# Altium schematic sheet 2DIR_Digital_Isolator.SchDoc: STM32F446 CNC
size B; Author: AM; CompanyName: Expatria Technologies; DrawnBy: A.Marles; Engineer: AM; Organization: Expatria Technolgoies; DocumentNumber: 9; SheetNumber: 9; SheetTotal: 14
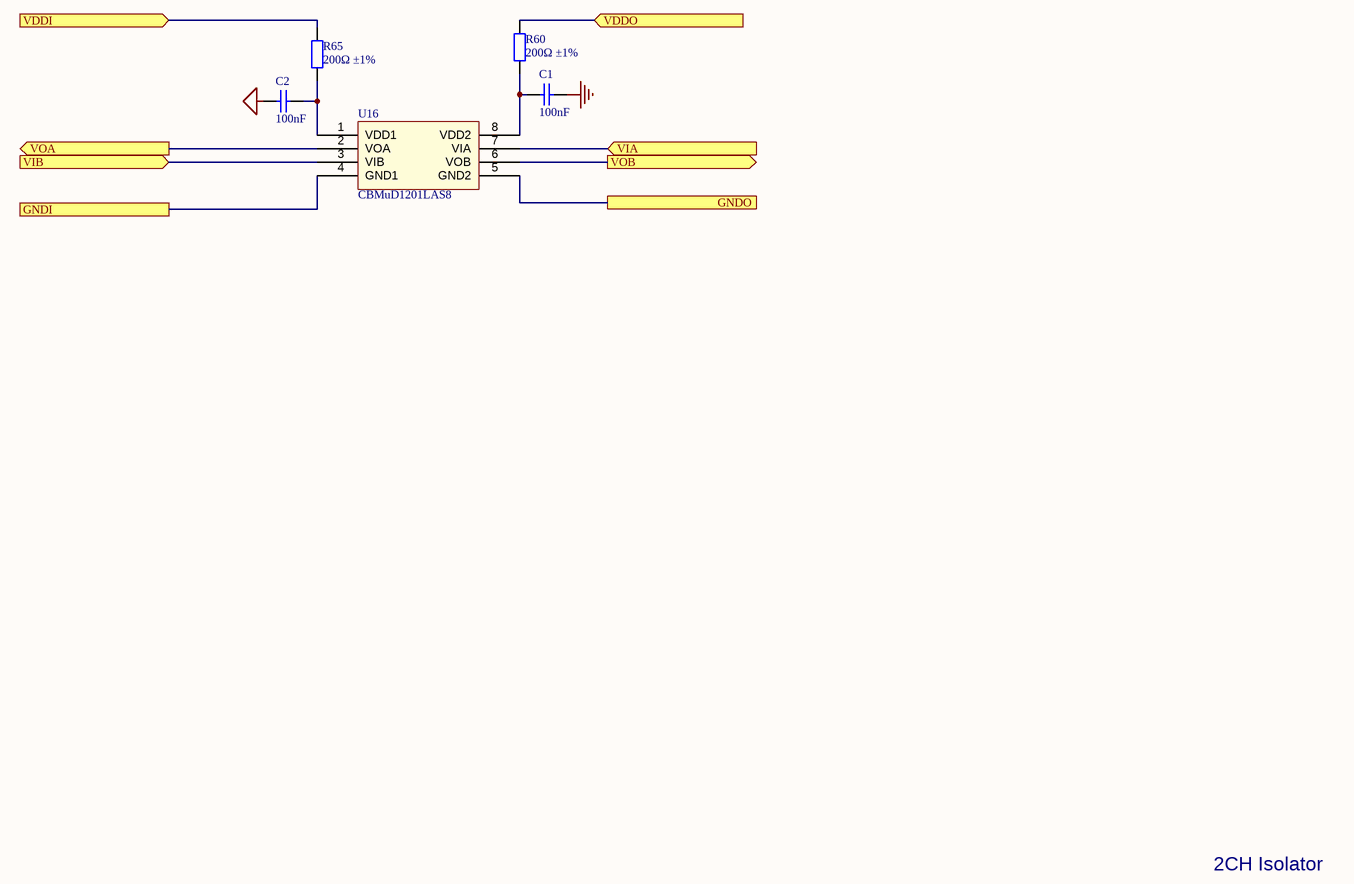
[diagram p0: 2DIR_Digital_Isolator.SchDoc]

## Parts
C1  100nF  [0603_C]
C2  100nF  [0603_C]
R60  200Ω ±1%  [0603_R]
R65  200Ω ±1%  [0603_R]
U16  CBMuD1201LAS8  [SOIC-8_150mil]

## Ports
GNDI, GNDO, VDDI (in), VDDO (in), VIA (in), VIB (in), VOA (out), VOB (out)

## Nets
GND: C1.1
MCU_GND: C2.2
GNDI: U16.4(GND1) ; port GNDI
GNDO: U16.5(GND2) ; port GNDO
VDDI: R65.2 ; port VDDI
VDDO: R60.2 ; port VDDO
VIA: U16.7(VIA) ; port VIA
VIB: U16.3(VIB) ; port VIB
VOA: U16.2(VOA) ; port VOA
VOB: U16.6(VOB) ; port VOB
NetC1_2: C1.2 R60.1 U16.8(VDD2)
NetC2_1: C2.1 R65.1 U16.1(VDD1)

## Notes on the sheet
- 2CH Isolator
- SHEET
- Expatria Technologies
- 1136 Glade Court
- Port Coquitlam, BC V3B 1R5
- PROJECT
- SIZE
- ENGR
- MODIFIED
- DOCUMENT
- REV
- Copyright Expatria Technologies 2022. This document describes Open Hardware and is licensed under the CERN-OHL-S v2. No warranty is implied or expressed.
- EMAIL: INFO@EXPATRIA.CA
- B
- /

## Library data of the parts
C1 C2 = 0603 100nF (104) 10% 50V: Chip capacitors; Manufacturer: YAGEO; PartNumber: CC0603KRX7R9BB104; Tolerance: 10%; Voltage: 50V; ComponentLink1Description: Supplier link; ComponentLink1URL: http://www.szlcsc.com/product/details_15331.html; Package: 0603; Supplier: LC; SuppliersPartNumber: C14663; Capacitance: 100nF
R60 R65 = 0603 200R (2000) 1%: Chip resistor; Manufacturer: Uniroyal Elec; PartNumber: 0603WAF2000T5E; Power: 1/10W; ComponentLink1Description: Supplier link; ComponentLink1URL: http://www.szlcsc.com/product/details_8708.html; Package: 0603; Supplier: LC; SuppliersPartNumber: C8218; Resistance: 200Ω; Tolerance: 1%
U16 = CBMuD1201LAS8: Dual Channel Isolator; Manufacturer: Corebai Microelectronics; Package: SOIC-8_150mil; Supplier: LC; SuppliersPartNumber: C476472; ComponentLink1Description: 供应商链接; ComponentLink1URL: http://www.szlcsc.com/product/details_10199.html; Manufacturer Part Number: CBMuD1201LAS8